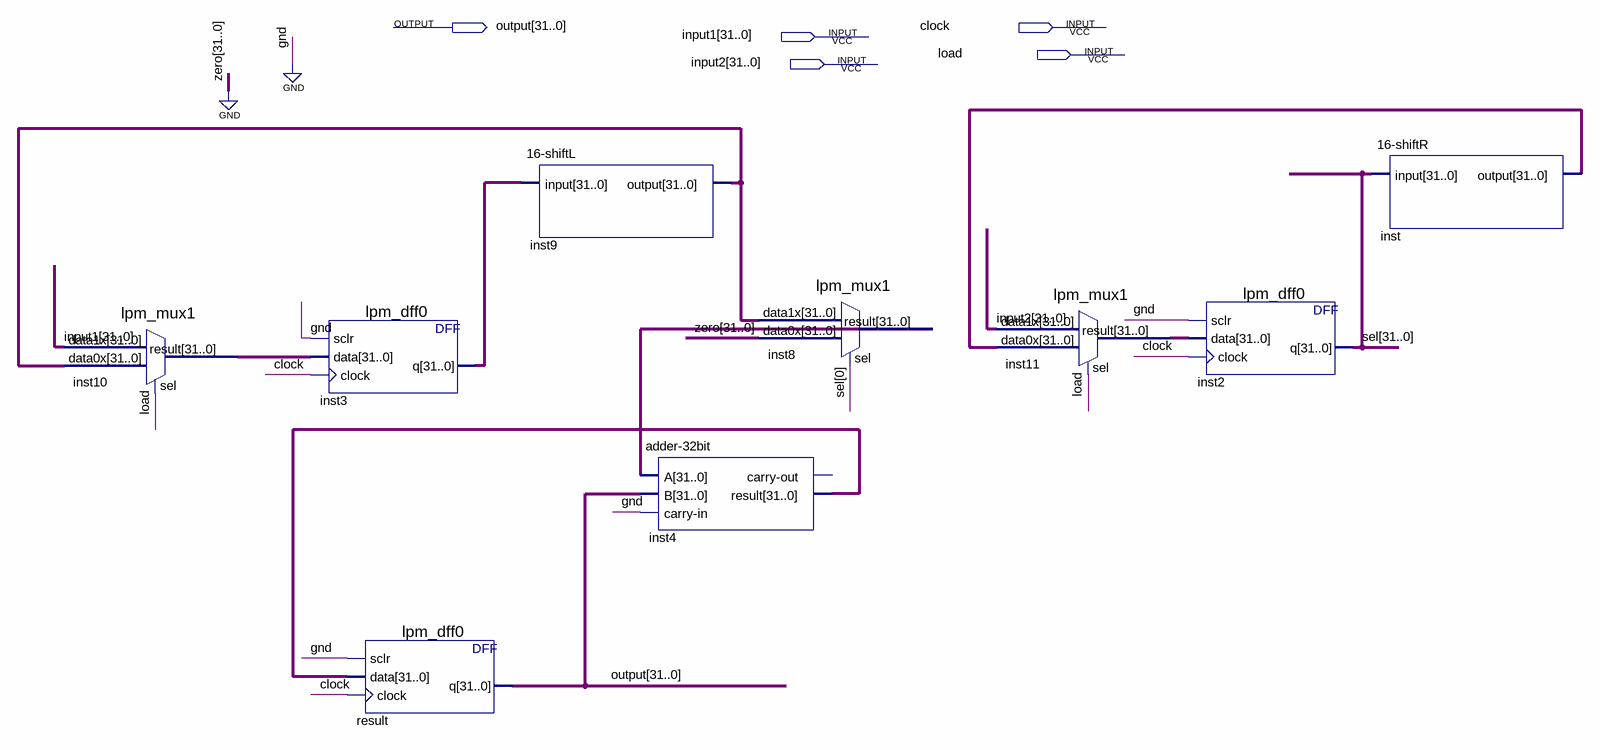
[diagram p0: schematic sheet]
// Quartus schematic multiplier.bdf as structural Verilog: 9 symbols, 5 pins
module multiplier (
  input  clock,
  input  [31:0] input1,
  input  load,
  input  [31:0] input2,
  output [31:0] \output 
);

  wire [31:0] inst3_q, inst4_result, inst8_result, inst9_output, inst10_result, inst11_result, inst_output,
       sel;

  lpm_mux1 inst10 (.data1x(input1), .data0x(inst9_output), .sel(load), .result(inst10_result));
  lpm_dff0 inst3 (.sclr(1'b0), .data(inst10_result), .clock(clock), .q(inst3_q));
  lpm_dff0 result (.sclr(1'b0), .data(inst4_result), .clock(clock), .q(\output ));
  \16-shiftL  inst9 (.\input (inst3_q), .\output (inst9_output));
  \adder-32bit  inst4 (.A(inst8_result), .B(\output ), .\carry-in (1'b0), .result(inst4_result));  // open: carry-out
  lpm_mux1 inst8 (.data1x(inst9_output), .data0x({32{1'b0}}), .sel(sel[0]), .result(inst8_result));
  lpm_mux1 inst11 (.data1x(input2), .data0x(inst_output), .sel(load), .result(inst11_result));
  lpm_dff0 inst2 (.sclr(1'b0), .data(inst11_result), .clock(clock), .q(sel));
  \16-shiftR  inst (.\input (sel), .\output (inst_output));
endmodule
